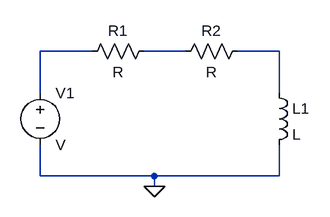
[diagram p0: schematic Prueba2.asc]
Prueba2.asc, the LTspice schematic file:
Version 4
SHEET 1 880 680
WIRE 160 80 80 80
WIRE 304 80 240 80
WIRE 448 80 384 80
WIRE 80 144 80 80
WIRE 448 144 448 80
WIRE 80 272 80 224
WIRE 256 272 80 272
WIRE 448 272 448 224
WIRE 448 272 256 272
WIRE 256 288 256 272
FLAG 256 288 0
SYMBOL voltage 80 128 R0
SYMATTR InstName V1
SYMBOL res 256 64 R90
WINDOW 0 0 56 VBottom 2
WINDOW 3 32 56 VTop 2
SYMATTR InstName R1
SYMBOL ind 432 128 R0
SYMATTR InstName L1
SYMBOL res 400 64 R90
WINDOW 0 0 56 VBottom 2
WINDOW 3 32 56 VTop 2
SYMATTR InstName R2

The netlist it stands for:
* Prueba2.asc
V1 N001 0 V
R1 N002 N001 R
L1 N003 0 L
R2 N003 N002 R
.backanno
.end